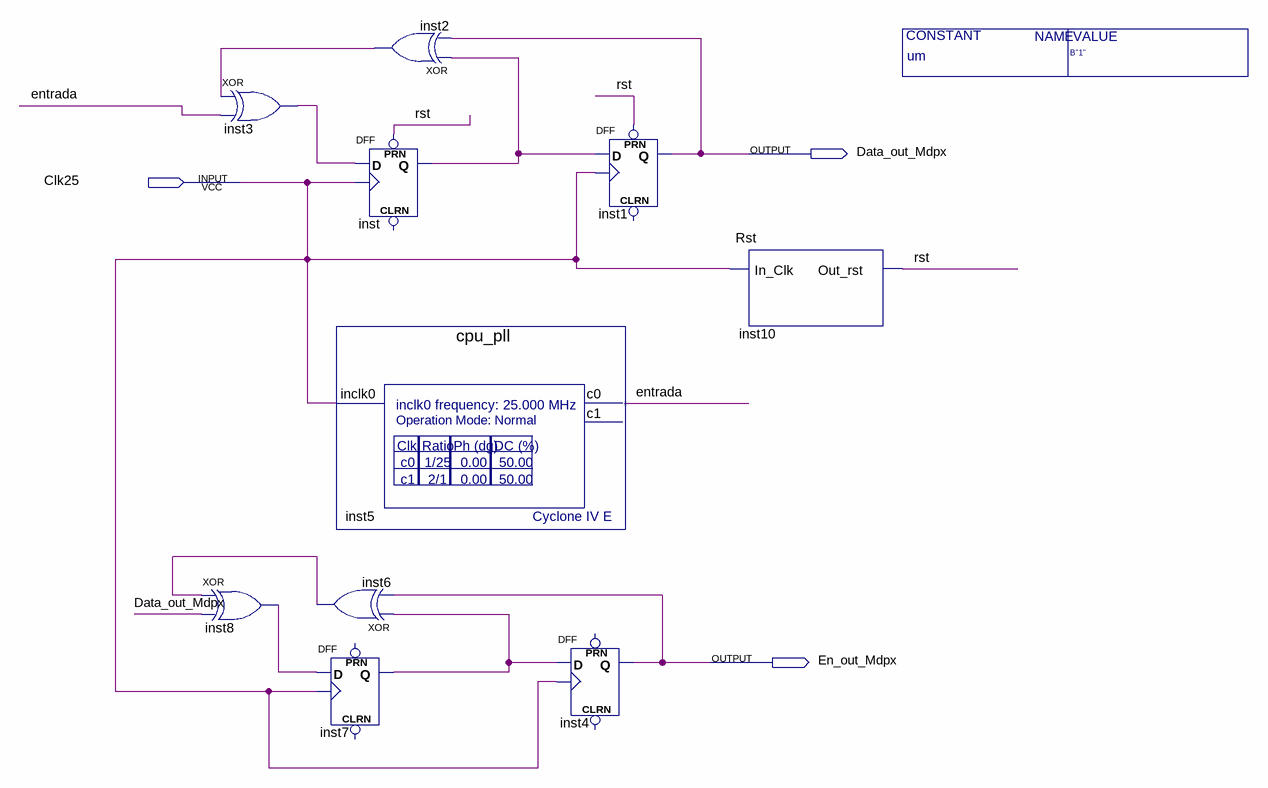
[diagram p0: schematic sheet]
// Quartus schematic Top_Medipix.bdf as structural Verilog: 10 symbols, 3 pins
module Top_Medipix #(parameter um = 'b1) (
  input  Clk25,
  output Data_out_Mdpx,
  output En_out_Mdpx
);

  wire entrada, inst2_out, inst3_out, inst6_out, inst7_q, inst8_out, inst_q, rst;

  xor inst3 (inst3_out, inst2_out, entrada);
  xor inst8 (inst8_out, inst6_out, Data_out_Mdpx);
  xor inst6 (inst6_out, inst7_q, En_out_Mdpx);
  DFF inst7 (.CLK(Clk25), .D(inst8_out), .Q(inst7_q));  // open: CLRN, PRN
  xor inst2 (inst2_out, inst_q, Data_out_Mdpx);
  DFF inst (.CLK(Clk25), .D(inst3_out), .PRN(rst), .Q(inst_q));  // open: CLRN
  cpu_pll inst5 (.inclk0(Clk25), .c0(entrada));  // open: c1
  DFF inst4 (.CLK(Clk25), .D(inst7_q), .Q(En_out_Mdpx));  // open: CLRN, PRN
  DFF inst1 (.CLK(Clk25), .D(inst_q), .PRN(rst), .Q(Data_out_Mdpx));  // open: CLRN
  Rst inst10 (.In_Clk(Clk25), .Out_rst(rst));
endmodule
